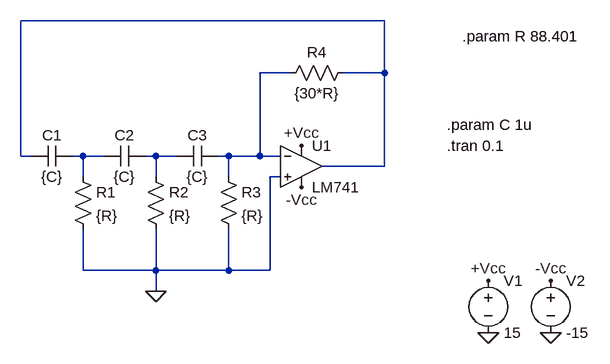
[diagram p0: schematic 2017AAPS1734H_Run4.asc]
2017AAPS1734H_Run4.asc, the LTspice schematic file:
Version 4
SHEET 1 880 680
WIRE 336 -48 -224 -48
WIRE 192 32 144 32
WIRE 336 32 336 -48
WIRE 336 32 272 32
WIRE -224 160 -224 -48
WIRE -208 160 -224 160
WIRE -128 160 -144 160
WIRE -96 160 -128 160
WIRE -16 160 -32 160
WIRE 16 160 -16 160
WIRE 96 160 80 160
WIRE 144 160 144 32
WIRE 144 160 96 160
WIRE 176 160 144 160
WIRE 336 176 336 32
WIRE 336 176 240 176
WIRE -128 192 -128 160
WIRE -16 192 -16 160
WIRE 96 192 96 160
WIRE 176 192 160 192
WIRE -128 336 -128 272
WIRE -16 336 -16 272
WIRE -16 336 -128 336
WIRE 96 336 96 272
WIRE 96 336 -16 336
WIRE 160 336 160 192
WIRE 160 336 96 336
WIRE -16 368 -16 336
FLAG 496 432 0
FLAG 592 432 0
FLAG 496 352 +Vcc
FLAG 592 352 -Vcc
FLAG 208 144 +Vcc
FLAG 208 208 -Vcc
FLAG -16 368 0
SYMBOL voltage 496 336 R0
WINDOW 123 0 0 Left 0
WINDOW 39 24 124 Left 2
SYMATTR InstName V1
SYMATTR Value 15
SYMBOL voltage 592 336 R0
SYMATTR InstName V2
SYMATTR Value -15
SYMBOL cap -144 144 R90
WINDOW 0 0 32 VBottom 2
WINDOW 3 32 32 VTop 2
SYMATTR InstName C1
SYMATTR Value {C}
SYMBOL cap -32 144 R90
WINDOW 0 0 32 VBottom 2
WINDOW 3 32 32 VTop 2
SYMATTR InstName C2
SYMATTR Value {C}
SYMBOL cap 80 144 R90
WINDOW 0 0 32 VBottom 2
WINDOW 3 32 32 VTop 2
SYMATTR InstName C3
SYMATTR Value {C}
SYMBOL res -144 176 R0
SYMATTR InstName R1
SYMATTR Value {R}
SYMBOL res -32 176 R0
SYMATTR InstName R2
SYMATTR Value {R}
SYMBOL res 80 176 R0
SYMATTR InstName R3
SYMATTR Value {R}
SYMBOL res 288 16 R90
WINDOW 0 0 56 VBottom 2
WINDOW 3 32 56 VTop 2
SYMATTR InstName R4
SYMATTR Value {30*R}
SYMBOL Opamps\\LM741 208 112 R0
SYMATTR InstName U1
TEXT 432 112 Left 2 !.param C 1u
TEXT 432 144 Left 2 !.tran 0.1
TEXT 456 -24 Left 2 !.param R 88.401

The netlist it stands for:
* 2017AAPS1734H_Run4.asc
V1 +Vcc 0 15
V2 -Vcc 0 -15
C1 N003 N001 {C}
C2 N004 N003 {C}
C3 N002 N004 {C}
R1 N003 0 {R}
R2 N004 0 {R}
R3 N002 0 {R}
R4 N001 N002 {30*R}
XU1 0 N002 +Vcc -Vcc N001 LM741  ; pins In+ In- V+ V- OUT
.param C 1u
.tran 0.1
.param R 88.401
.lib LM741.lib
.backanno
.end